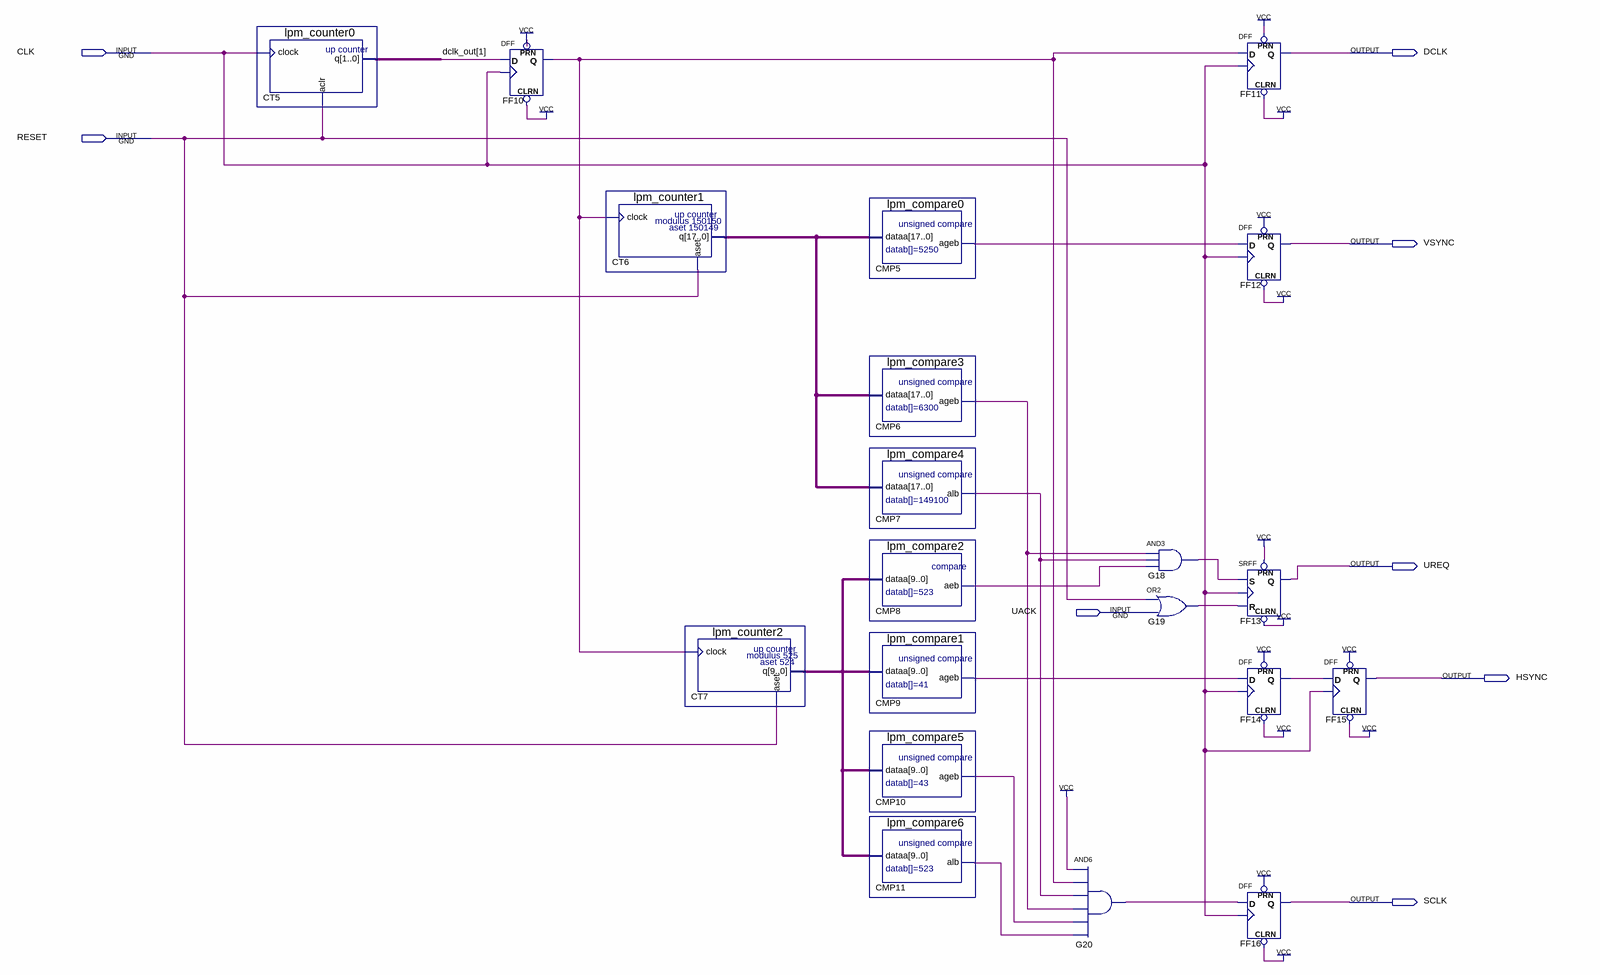
[diagram p0: schematic sheet]
// Quartus schematic display_ctrl.bdf as structural Verilog: 20 symbols, 8 pins
module display_ctrl (
  input  CLK,
  input  RESET,
  input  UACK,
  output DCLK,
  output VSYNC,
  output UREQ,
  output HSYNC,
  output SCLK
);

  wire CMP5_ageb, CMP6_ageb, CMP7_alb, CMP8_aeb, CMP9_ageb, CMP10_ageb, CMP11_alb, FF10_q, FF14_q, G18_out,
       G19_out, G20_out;
  wire [1:0] dclk_out;
  wire [9:0] CT7_q;
  wire [17:0] CT6_q;

  lpm_counter0 CT5 (.clock(CLK), .aclr(RESET), .q(dclk_out));
  DFF FF10 (.CLRN(1'b1), .CLK(CLK), .D(dclk_out[1]), .PRN(1'b1), .Q(FF10_q));
  lpm_counter1 CT6 (.clock(FF10_q), .aset(RESET), .q(CT6_q));
  lpm_counter2 CT7 (.clock(FF10_q), .aset(RESET), .q(CT7_q));
  lpm_compare0 CMP5 (.dataa(CT6_q), .ageb(CMP5_ageb));
  lpm_compare3 CMP6 (.dataa(CT6_q), .ageb(CMP6_ageb));
  lpm_compare4 CMP7 (.dataa(CT6_q), .alb(CMP7_alb));
  lpm_compare2 CMP8 (.dataa(CT7_q), .aeb(CMP8_aeb));
  lpm_compare1 CMP9 (.dataa(CT7_q), .ageb(CMP9_ageb));
  lpm_compare5 CMP10 (.dataa(CT7_q), .ageb(CMP10_ageb));
  lpm_compare6 CMP11 (.dataa(CT7_q), .alb(CMP11_alb));
  and G20 (G20_out, 1'b1, FF10_q, CMP7_alb, CMP6_ageb, CMP10_ageb, CMP11_alb);
  and G18 (G18_out, CMP6_ageb, CMP7_alb, CMP8_aeb);
  or G19 (G19_out, RESET, UACK);
  DFF FF11 (.CLRN(1'b1), .CLK(CLK), .D(FF10_q), .PRN(1'b1), .Q(DCLK));
  DFF FF12 (.CLRN(1'b1), .CLK(CLK), .D(CMP5_ageb), .PRN(1'b1), .Q(VSYNC));
  SRFF FF13 (.PRN(1'b1), .CLRN(1'b1), .S(G18_out), .R(G19_out), .CLK(CLK), .Q(UREQ));
  DFF FF14 (.CLRN(1'b1), .CLK(CLK), .D(CMP9_ageb), .PRN(1'b1), .Q(FF14_q));
  DFF FF16 (.CLRN(1'b1), .CLK(CLK), .D(G20_out), .PRN(1'b1), .Q(SCLK));
  DFF FF15 (.CLRN(1'b1), .CLK(CLK), .D(FF14_q), .PRN(1'b1), .Q(HSYNC));
endmodule
